# Altium schematic sheet EVK-NORA-W1_SCHEM_0006_Accessories.SchDoc
size B; Date: 7/24/2020; CompanyName: U-blox; DrawnBy: EMOO; Engineer: EMOO; Organization: U-blox; Address1: 3950 Fairview Industrial Dr SE #100; Address2: Salem, OR 97302; Revision: A; SheetNumber: 6; SheetTotal: 6; SheetSize: B; SheetTitle: Accessories

## Parts
?  (no value)  (graphical)

## Notes on the sheet
- Revision:
- Page:

## Library data of the parts
? = Sub_Title_Block: Minimized schematic title block for all subset sheets